# EAGLE design usb-brick_2.03 (EAGLE 7.2.0)
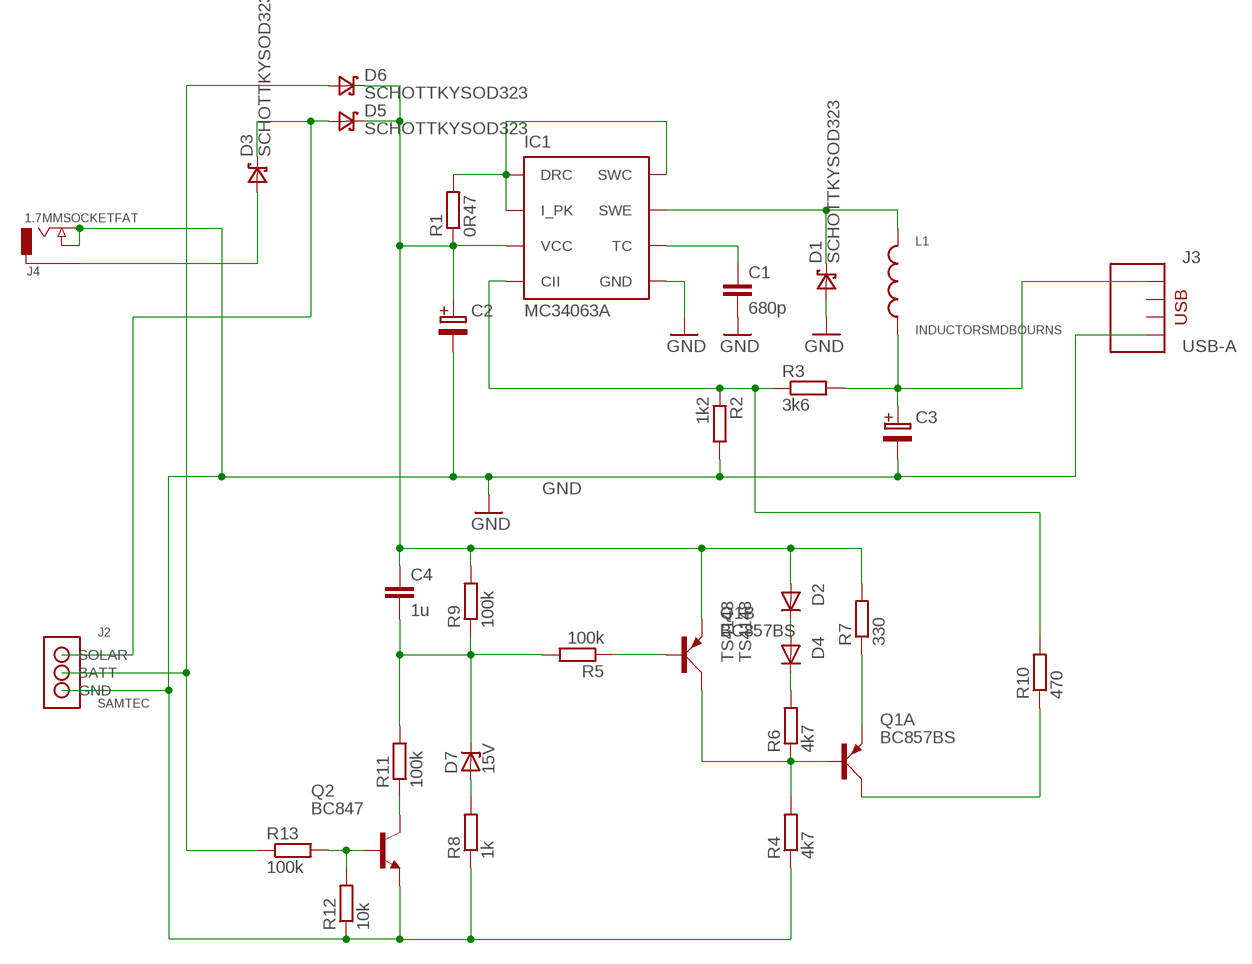
[diagram p0: schematic, sheet 1]

## Parts
C1  680p  C-EUC0603  [C0603]
C2  ELEC_CAP_CANVZH101  [CAPCANVZH101]
C3  ELEC_CAP_CANVZH101  [CAPCANVZH101]
C4  1u  C-EUC0603  [C0603]
D1  SCHOTTKYSOD323  [SOD323]
D2  TS4148  [0805]
D3  SCHOTTKYSOD323  [SOD323]
D4  TS4148  [0805]
D5  SCHOTTKYSOD323  [SOD323]
D6  SCHOTTKYSOD323  [SOD323]
D7  15V  ZENER-DIODESOT23  [SOT23]
IC1  MC34063A  [SOIC8]
J2  SAMTEC  [SAMTEC]
J3  USB-A  [USB-A]
J4  1.7MMSOCKETFAT  [1.7MMSOCKET-OBLONGFAT]
L1  INDUCTORSMDBOURNS  [INDUCTOR_BOURNS]
Q1  BC857BS  [SOT363_PHILIPS]
Q2  BC847  [SOT23]
R1  0R47  R-EU_R1206  [R1206]
R2  1k2  R-EU_R0603  [R0603]
R3  3k6  R-EU_R0603  [R0603]
R4  4k7  R-EU_R0603  [R0603]
R5  100k  R-EU_R0603  [R0603]
R6  4k7  R-EU_R0603  [R0603]
R7  330  R-EU_R0603  [R0603]
R8  1k  R-EU_R0603  [R0603]
R9  100k  R-EU_R0603  [R0603]
R10  470  R-EU_R0603  [R0603]
R11  100k  R-EU_R0603  [R0603]
R12  10k  R-EU_R0603  [R0603]
R13  100k  R-EU_R0603  [R0603]

## Nets
C3: C3.+VE(P$1+) J3.5V L1.P$2 R3.2
GND: C1.2 C2.-VE C3.-VE D1.ANODE IC1.GND J2.GND J3.GND J4.-VE J4.P$3 Q2.2(E) R2.2 R4.1 R8.1 R12.1
N$1: D1.CATHODE IC1.SWE L1.P$1
N$2: D3.CATHODE D5.ANODE J2.SOLAR
N$3: C2.+VE(P$1+) C4.1 D2.A D5.CATHODE D6.CATHODE IC1.VCC Q1.4(B:E) R1.1 R7.2 R9.2
N$4: IC1.CII R2.1 R3.1 R10.2
N$6: C1.1 IC1.TC
N$7: Q1.2(A:B) Q1.3(B:C) R4.2 R6.1
N$8: Q1.6(A:C) R10.1
N$10: D3.ANODE J4.+VE
N$11: C4.2 D7.3(C) R5.2 R9.1 R11.2
N$13: D2.C D4.A
N$14: Q1.1(A:E) R7.1
N$15: IC1.DRC IC1.I_PK IC1.SWC R1.2
N$16: Q1.5(B:B) R5.1
N$17: D7.1(A) R8.2
N$18: D4.C R6.2
N$19: Q2.1(B) R12.2 R13.2
N$20: Q2.3(C) R11.1
N$21: D6.ANODE J2.BATT R13.1
Unconnected: J3.P$1 J3.P$2 J3.P$5 J3.P$6

## Library data of the parts
C1 C4 = rcl:C-EU: CAPACITOR, European symbol
C2 C3 = myBattery100lib:ELEC_CAP_CAN
D1 D3 D5 D6 = mylib:SCHOTTKY: DIODE; OC_FARNELL: 8737991
D2 D4 = avago-led:TS4148
D7 = diode:ZENER-DIODE: Z-Diode
IC1 = mylib:MC34063A; OC_FARNELL: 1053582
J2 = mylib:SAMTEC
J3 = mylib:USB-A
J4 = mylib:1.7MMSOCKET
L1 = mylib:INDUCTORSMD
Q1 = avago-led:BC857BS
Q2 = transistor:BC847: NPN TRANSISTOR
R1-R13 = rcl:R-EU_: RESISTOR, European symbol

## Board
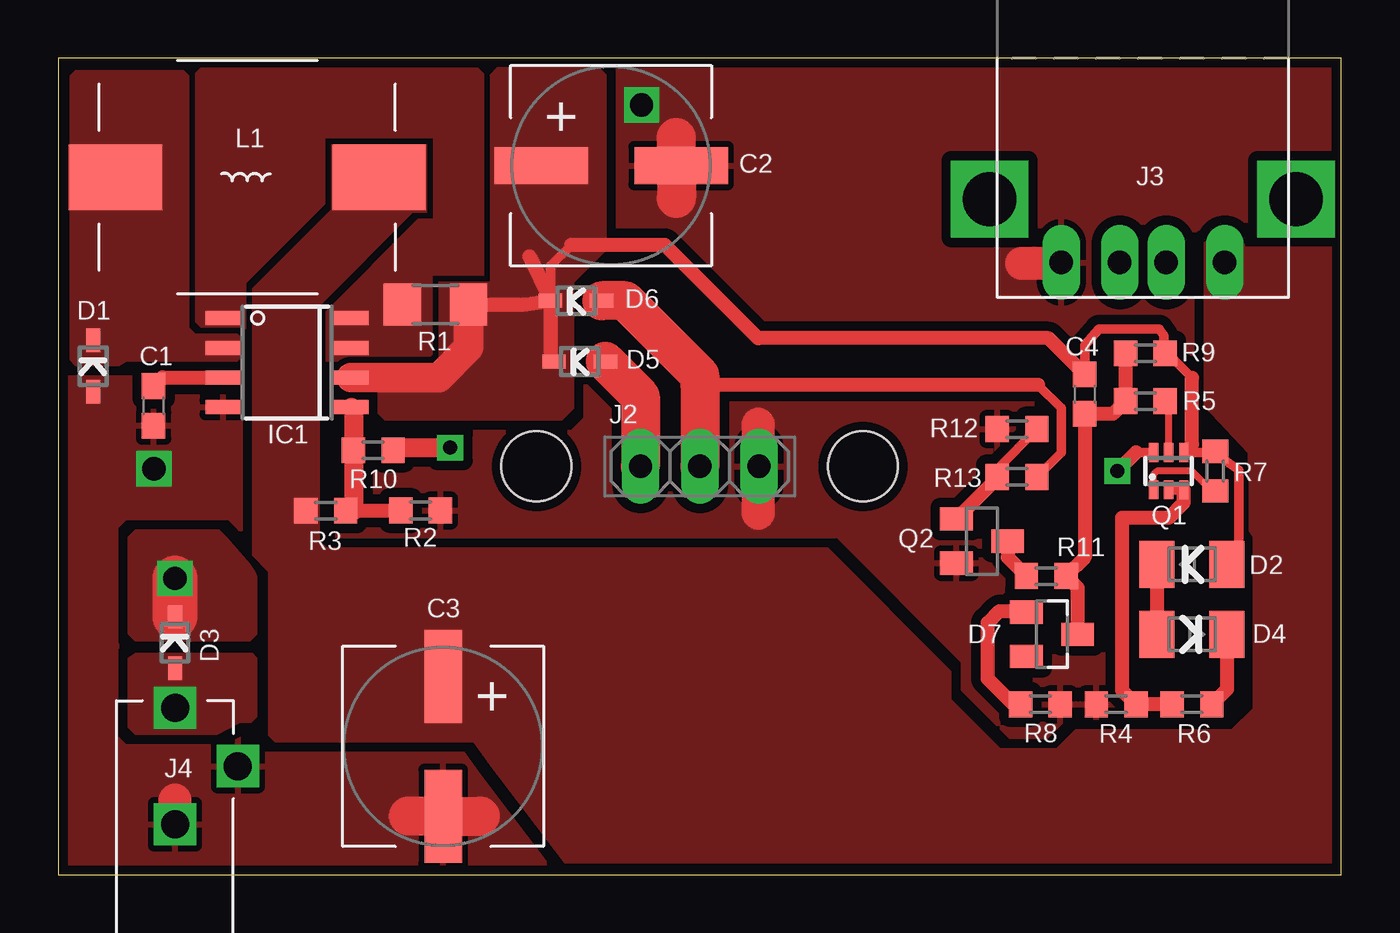
[diagram p1: board, top side]
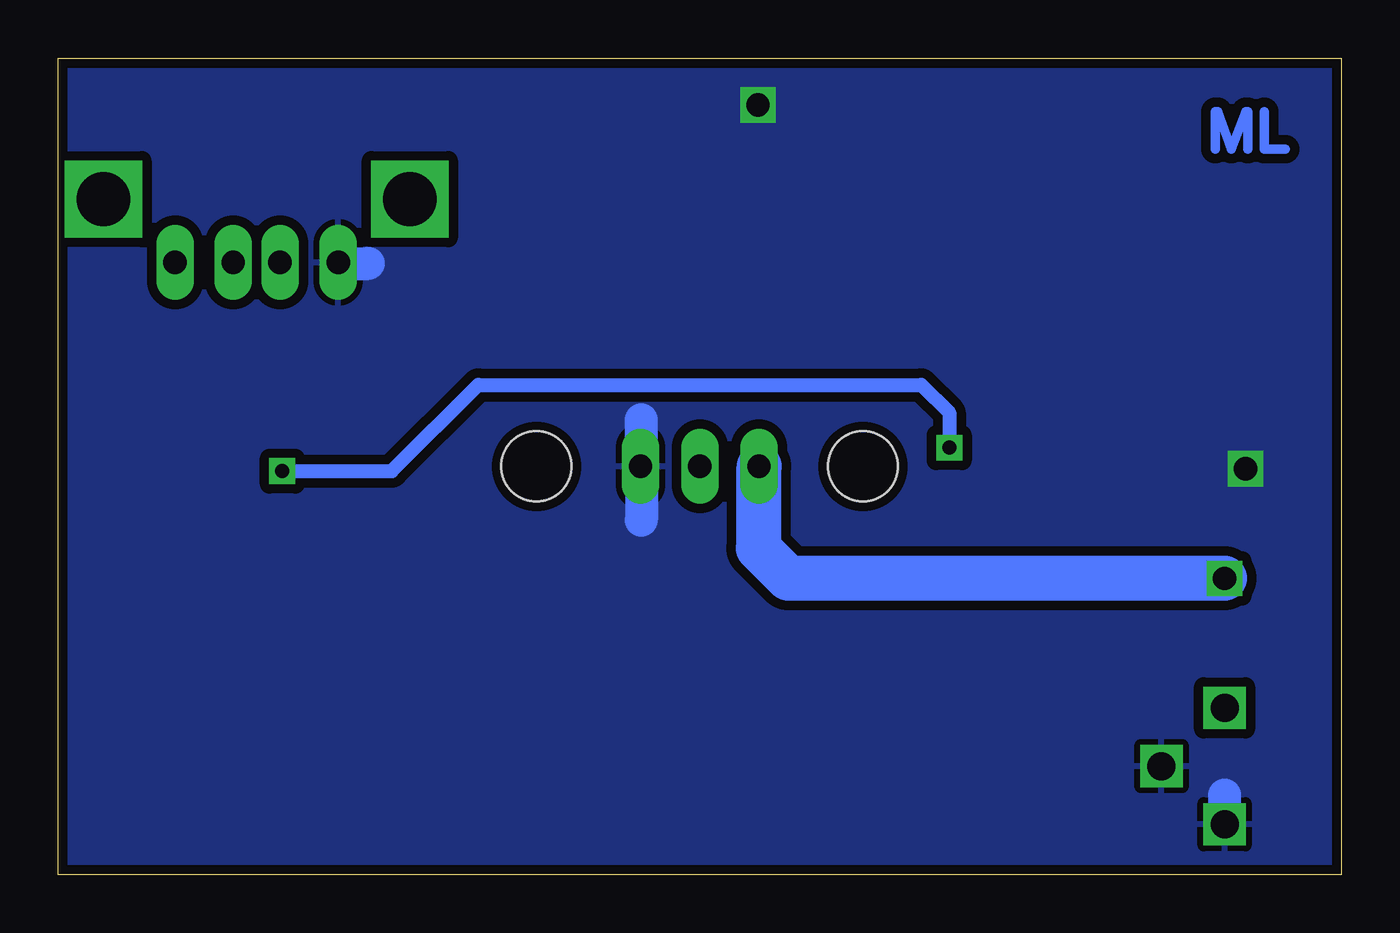
[diagram p2: board, bottom side, seen from below]

Size 55 x 35 mm. Coordinates in mm from the lower left corner, seen from the top.
Outline: 0,0 55,0 55,35 0,35 0,0
Copper layers (1*16): Top 0.035mm / dielectric 1.5mm / Bottom 0.035mm
Design rules "myRules": minimum track width 8mil, minimum drill 20mil, track to track 8mil, track to pad 8mil, pad to pad 9mil, via to via 8mil, smd to smd 8mil, copper to edge 10mil, drill to drill 8mil, minimum pad ring 12mil, minimum via ring 10mil, stop-mask expansion 3mil, vias tented up to drill 40mil, thermal gap 10mil
Holes 3 mm at 20.5,17.5 34.5,17.5
tKeepout: area 31.8,14.8 to 37.2,20.2; area 17.8,14.8 to 23.2,20.2

### Footprints (pad centres in the part's own frame; a part is rotated, then mirrored left to right if it is on the bottom)
C0603 = smd 1.1 x 1: 1 -0.85,0; 2 0.85,0
CAPCANVZH101 = smd 1.6 x 4: +VE 0,3; -VE 0,-3
SOD323 = smd 1 x 0.6: ANODE 1.1,0; CATHODE -1.1,0
0805 = smd 1.5 x 2: A 1.5,0; C -1.5,0
SOT23 = smd 1 x 1.4: 1 -0.95,-1.1; 2 0.95,-1.1; 3 0,1.1
SOIC8 = smd 1.5 x 0.6: CII 0.21,-1.905; DRC 0.21,1.905; GND -5.29,-1.905; I_PK 0.21,0.635; SWC -5.29,1.905; SWE -5.29,0.635; TC -5.29,-0.635; VCC 0.21,-0.635
SAMTEC = drill 1 long: BATT 0,0; GND 2.54,0; SOLAR -2.54,0
USB-A = drill 1 long: 5V -3.5,0; GND 3.5,0; P$1 1,0; P$2 -1,0 | drill 2.3 square: P$5 6.57,-2.71; P$6 -6.57,-2.71
1.7MMSOCKET-OBLONGFAT = drill 1.2 square: +VE 0,0; -VE 0,-5; P$3 2.7,-2.5
INDUCTOR_BOURNS = smd 4 x 2.8: P$1 5.65,0; P$2 -5.65,0
SOT363_PHILIPS = smd 0.4 x 0.8: 1 -0.65,-0.8; 2 0,-0.8; 3 0.65,-0.8; 4 0.65,0.8; 5 0,0.8; 6 -0.65,0.8
R1206 = smd 1.6 x 1.803: 1 -1.422,0; 2 1.422,0
R0603 = smd 1 x 1.1: 1 -0.85,0; 2 0.85,0

### Placement (x,y rotation side)
C1  4.08,20.09 270 top
C2  23.7,30.4 90 top
C3  16.5,5.5 0 top
C4  44,20.6 270 top
D1  1.5,21.8 270 top
D2  48.6,13.3 0 top
D3  5,9.95 270 top
D4  48.6,10.3 180 top
D5  22.35,22 0 top
D6  22.2,24.6 0 top
D7  42.6,10.3 270 top
IC1  12.35,21.95 0 top
J2  27.5,17.5 0 top
J3  46.5,26.25 180 top
J4  5,7.15 0 top
L1  8.1,29.9 180 top
Q1  47.6,17.3 0 top
Q2  39.6,14.3 270 top
R1  16.17,24.44 180 top
R2  15.53,15.61 0 top
R3  11.47,15.6 180 top
R4  45.35,7.3 0 top
R5  46.6,20.3 180 top
R6  48.6,7.3 0 top
R7  49.6,17.3 90 top
R8  42.1,7.3 180 top
R9  46.6,22.35 0 top
R10  13.5,18.2 180 top
R11  42.35,12.8 0 top
R12  41.1,19.1 0 top
R13  41.1,17.05 180 top

### Tracks (layer width: path | path; a pad name or v marks a point on that pad's centre or on a via)
C3
  pour Top (no thermals): 8.3,25.1 8.3,13.7 9,13 9,6 9.3,5.7 17.8,5.7 18.5,4.7 21.7,0.5 54.6,0.5 54.6,26.9 50.9,26.9 50.7,27.3 49.5,27.3 49.1,27.1 49.1,20.1 51,18.1 51,14.8 51.2,14.5 51.2,7.1 50.3,6.2 43.6,6.2 42.8,5.4 40.4,5.4 38.3,7.5 38.3,8.7 33,14 11.5,14 11.2,14.3 11.2,24.4 15.2,28.4 15.8,28.4 15.8,31.3 11.7,31.3 11.7,28.5
GND  (via drill 1)
  Top 1.422: 5,2.2 5,3.2 | 30,19.3 30,15.5 | 43,26.2 41.3,26.2
  Top 1.676: 18.1,2.5 C3.-VE 15,2.5 | 26.5,29 26.5,30.6 26.5,31.6
  Bottom 1.422: 5,2.2 5,3.4 | 30.1,17.5 30,17.5 | 30,17.5 30,19.5 | 30,17.5 30,15.2 | 43,26.2 41.7,26.2
  other vias: 25,33 4.1,17.4
  pour Bottom (isolate 0.406, rank 4): 0,0 55,0 55,35 0,35
  pour Top (isolate 0.406, rank 4): 0,0 55,0 55,35 0,35
  pour Top (no thermals): 0.7,21.4 2.3,21.4 2.3,19.7 0.7,19.7
N$1
  pour Top (no thermals): 2.6,21.8 0.75,21.8 0.5,22.05 0.5,34.25 0.75,34.5 5.35,34.5 5.6,34.25 5.6,23.45 5.85,23.2 7.65,23.2 7.9,22.95 7.9,22.25 7.65,22 2.9,22
N$2  (via drill 1)
  Top 1.676: D5.ANODE 24.96,20.49 J2.SOLAR
  Top 1.93: D3.CATHODE v5,12.7
  Bottom 1.93: v5,12.7 23.7,12.7 25,14 24.96,14 J2.SOLAR
  pour Top: 8.2,10 3.32,10 3,10.32 3,14.48 3.32,14.8 6.88,14.8 7.2,14.48 8.2,13.32 8.42,13 8.47,12.88 8.49,12.79 8.5,12.68 8.5,10.3
N$3
  Top 0.406: R7.2 49.55,18.1 | 49.55,18.1 Q1.4 48.6,18.45 | 49.55,18.1 50.6,17.35 50.6,13.3 D2.A | 48.6,21.3 47.85,22.05 R9.2 47.4,22.4 47.4,23.1 47.2,23.4 44.6,23.4 44,22.7 C4.1 | 22,27 21.1,26.1 D6.CATHODE
  Top 0.61: 48.6,18.45 48.6,21.3 | C4.1 42.45,23 30,23 26,27 22,27 | R1.1 19.94,24.44 D6.CATHODE | D6.CATHODE 21.1,22.15 D5.CATHODE | 20.2,26.5 D6.CATHODE
  Top 1.27: IC1.VCC 16.32,21.32 17.59,22.59 R1.1
  pour Top (no thermals): 23.18,34.6 18.82,34.6 18.5,34.28 18.5,25.4 16.3,25.4 16.3,21.8 14,21.8 13.7,21.5 13.7,19.82 14.02,19.5 21.6,19.5 22.1,20 22.1,25.4 23.5,26.8 23.5,34.28
N$4
  Top 0.61: R3.1 R2.1
  Top 0.813: IC1.CII 12.65,19.95 R10.2 12.65,15.6 R3.1
N$6
  Top 0.61: C1.1 4.46,21.32 IC1.TC
N$7
  Top 0.406: Q1.3 Q1.2
  Top 0.61: R6.1 R4.2 45.6,7.9 45.6,15.3 47.6,15.3 48.25,15.95 Q1.3
N$8  (via drill 0.6)
  Top 0.406: Q1.6 46.2,18.1
  Top 0.61: 46.2,18.1 v45.4,17.3
  Top 0.813: R10.1 14.35,18.3 v16.8,18.3
  Bottom 0.61: v45.4,17.3 40.7,17.3 37,21 18,21 16.8,19.8 v16.8,18.3
N$10
  pour Top (no thermals): 6.8,6 3.32,6 3,6.32 3,9.28 3.32,9.5 8.3,9.5 8.5,9.3 8.5,6.75 8.25,6.5 7.8,6.5
N$11
  Top 0.61: D7.3 43.7,12.3 R11.2 44,13.6 C4.2 45.2,19.75 R5.2 R9.1
N$12
  Bottom 0.406: 5.4,31.1 5.4,32.7 5.3,32.7 4.7,31.1 4.1,32.7 4,32.7 4,31.1
N$13
  Top 0.61: D2.C D4.A
N$14
  Top 0.254: R7.1 49.45,16.45
  Top 0.305: 49.45,16.45 48.6,17.3 47.1,17.3 46.95,17.15 Q1.1
N$15
  pour Top (isolate 0.254, rank 2, no thermals): 8.4,23.4 5.8,23.4 5.8,34.28 6.12,34.6 17.98,34.6 18.3,34.28 18.3,22 8.4,22
N$16
  Top 0.254: 47.6,20.15 R5.1
  Top 0.305: Q1.5 47.6,20.15
N$17
  Top 0.254: 41.45,11.3 D7.1
  Top 0.305: R8.2 40.95,7.3
  Top 0.61: 41.45,11.3 40.35,11.3 39.85,10.8 39.85,8.4 40.95,7.3
N$18
  Top 0.61: D4.C 50.1,7.95 R6.2
N$19
  Top 0.406: R12.2 40.25,17.4 R13.2 40.25,17
  Top 0.61: 40.25,17 Q2.1
N$20
  Top 0.61: Q2.3 40.7,13.6 R11.1
N$21
  Top 0.406: 42,21 43,20 43,18.1 R13.1
  Top 0.61: 42,21 27.5,21
  Top 1.676: J2.BATT 27.5,21 27.5,21.4 24.3,24.6 D6.ANODE
N$22
  Bottom 0.406: 3.3,32.7 3.3,31.1 2.4,31.1

### Text on the board
OrgLBR: (c) Shamba Technologies Ltd / Nov-2015 / Rev: 2.03